# Altium schematic sheet UAV2.0_DOC.SchDoc
size A4
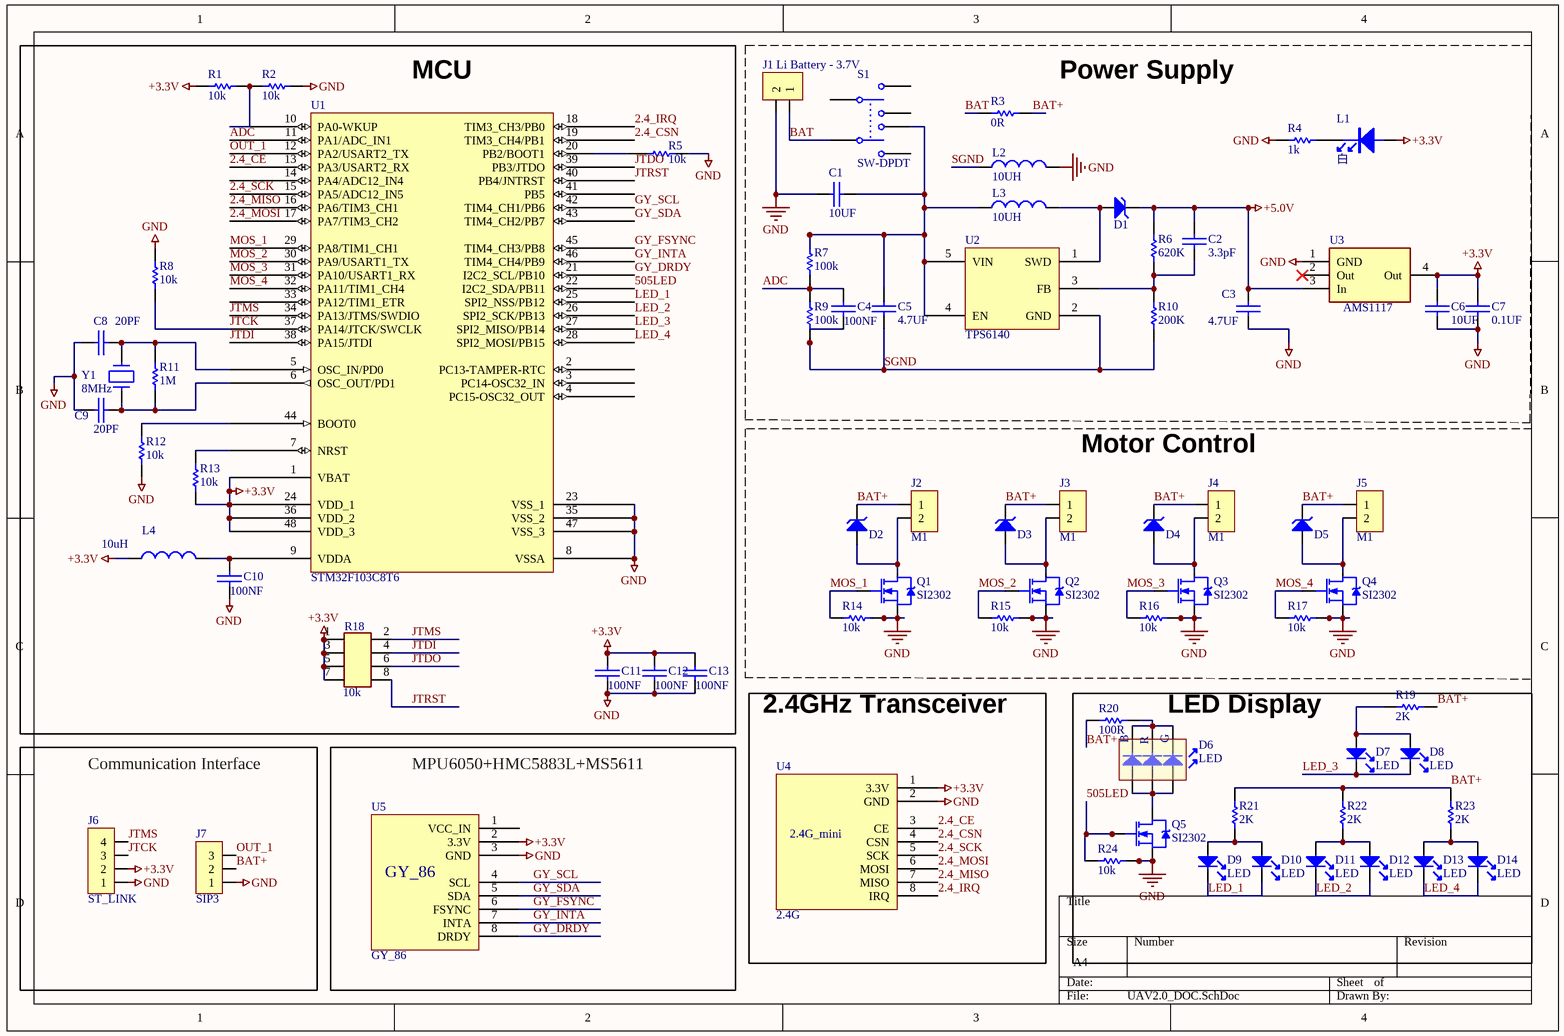
[diagram p0: UAV2.0_DOC.SchDoc]

## Parts
C1  10UF  [1206C]
C2  3.3pF  [0805C]
C3  4.7UF  [1206C]
C4  100NF  [0805C]
C5  4.7UF  [0805C]
C6  10UF  [1206C]
C7  0.1UF  [0805C]
C8  20PF  [0805C]
C9  20PF  [0805C]
C10  100NF  [0805C]
C11  100NF  [0805C]
C12  100NF  [0805C]
C13  100NF  [0805C]
D1  DIODE-S  [C_SMA_3216]  (value not drawn)
D2  DIODE-S  [C_SMA_3216]  (value not drawn)
D3  DIODE-S  [C_SMA_3216]  (value not drawn)
D4  DIODE-S  [C_SMA_3216]  (value not drawn)
D5  DIODE-S  [C_SMA_3216]  (value not drawn)
D6  LED  [LED5050_RGB]
D7  LED  [0805D]
D8  LED  [0805D]
D9  LED  [0805D]
D10  LED  [0805D]
D11  LED  [0805D]
D12  LED  [0805D]
D13  LED  [0805D]
D14  LED  [0805D]
J1  Li Battery - 3.7V  [P2_2.0-2]
J2  M1  [P2_2.0-1]
J3  M1  [P2_2.0-1]
J4  M1  [P2_2.0-1]
J5  M1  [P2_2.0-1]
J6  ST_LINK  [P4_2.54-1]
J7  SIP3  [PC_3]
L1  白  [D0805]
L2  10UH  [1206]
L3  10UH  [1206]
L4  Val: 10uH  [R0805]  (hidden comment: INDUCTOR)
Q1  SI2302  [SI2302]
Q2  SI2302  [SI2302]
Q3  SI2302  [SI2302]
Q4  SI2302  [SI2302]
Q5  SI2302  [SI2302]
R1  Val: 10k  [R0805]  (hidden comment: RES)
R2  Val: 10k  [R0805]  (hidden comment: RES)
R3  0R  [2512R - duplicate]
R4  value 1k  [R0805]  (hidden comment: Res1)
R5  Val: 10k  [R0805]  (hidden comment: RES)
R6  620K  [0805R]
R7  Val: 100k  [R0805]  (hidden comment: RES)
R8  Val: 10k  [R0805]  (hidden comment: RES)
R9  Val: 100k  [R0805]  (hidden comment: RES)
R10  200K  [0805R]
R11  Val: 1M  [R0805]  (hidden comment: RES)
R12  Val: 10k  [R0805]  (hidden comment: RES)
R13  Val: 10k  [R0805]  (hidden comment: RES)
R14  Val: 10k  [R0805]  (hidden comment: RES)
R15  Val: 10k  [R0805]  (hidden comment: RES)
R16  Val: 10k  [R0805]  (hidden comment: RES)
R17  Val: 10k  [R0805]  (hidden comment: RES)
R18  10k  [8P4R_0603]
R19  Val: 2K  [R0805]  (hidden comment: RES)
R20  100R  [0805R]
R21  Val: 2K  [R0805]  (hidden comment: RES)
R22  Val: 2K  [R0805]  (hidden comment: RES)
R23  Val: 2K  [R0805]  (hidden comment: RES)
R24  Val: 10k  [R0805]  (hidden comment: RES)
S1  SW-DPDT  [KEY_KFT7.0]
U1  STM32F103C8T6  [LQFP48_N]
U2  TPS6140  [SOT-23-5]
U3  AMS1117  [ZZ311]
U4  2.4G  [2.4G_mini]
U5  GY_86  [P8_2.54-1]
Y1  Val: 8MHz  [Y2]  (hidden comment: CRYSTAL1)

## Blocks framed on the sheet
MCU: C8-C13 L4 R1 R2 R5 R8 R11-R13 R18 U1 Y1
Motor Control: D2-D5 J2-J5 Q1-Q4 R14-R17
2.4GHz Transceiver: U4
LED Display: D6-D14 Q5 R19-R24
Communication Interface: J6 J7
MPU6050+HMC5883L+MS5611: U5

## Nets
+3.3V: C6.1 C7.1 C11.1 C12.1 C13.1 J6.2 L1.1 L4.1 R1.2 R13.1 R18.1(P) R18.3(P) R18.5(P) R18.7(P) U1.1(VBAT) U1.24(VDD_1) U1.36(VDD_2) U1.48(VDD_3) U3.4(Out) U4.1(3.3V) U5.2(3.3V)
+5.0V: C2.1 C3.1 D1.2 R6.2 U3.3(In)
GND: C1.1 C3.2 C6.2 C7.2 C8.1 C9.1 C10.2 C11.2 C12.2 C13.2 J1.2 J6.1 J7.1 L2.1 Q1.2(S) Q2.2(S) Q3.2(S) Q4.2(S) Q5.2(S) R2.1 R4.2 R5.2 R8.2 R12.1 R14.1 R15.1 R16.1 R17.1 R24.1 U1.8(VSSA) U1.23(VSS_1) U1.35(VSS_2) U1.47(VSS_3) U3.1(GND) U4.2(GND) U5.3(GND)
2.4_CE: U1.13(PA3/USART2_RX) U4.3(CE)
2.4_CSN: U1.19(TIM3_CH4/PB1) U4.4(CSN)
2.4_IRQ: U1.18(TIM3_CH3/PB0) U4.8(IRQ)
2.4_MISO: U1.16(PA6/TIM3_CH1) U4.7(MISO)
2.4_MOSI: U1.17(PA7/TIM3_CH2) U4.6(MOSI)
2.4_SCK: U1.15(PA5/ADC12_IN5) U4.5(SCK)
505LED: Q5.1(G) R24.2 U1.22(I2C2_SDA/PB11)
ADC: C4.1 R7.2 R9.1 U1.11(PA1/ADC_IN1)
BAT: J1.1 R3.1 S1.4
BAT+: D2.2 D3.2 D4.2 D5.2 J2.1 J3.1 J4.1 J5.1 J7.2 R3.2 R19.2 R20.1 R21.1 R22.1 R23.1
GY_DRDY: U1.21(I2C2_SCL/PB10) U5.8(DRDY)
GY_FSYNC: U1.45(TIM4_CH3/PB8) U5.6(FSYNC)
GY_INTA: U1.46(TIM4_CH4/PB9) U5.7(INTA)
GY_SCL: U1.42(TIM4_CH1/PB6) U5.4(SCL)
GY_SDA: U1.43(TIM4_CH2/PB7) U5.5(SDA)
JTCK: J6.3 R8.1 U1.37(PA14/JTCK/SWCLK)
JTDI: R18.4(P) U1.38(PA15/JTDI)
JTDO: R18.6(P) U1.39(PB3/JTDO)
JTMS: J6.4 R18.2(P) U1.34(PA13/JTMS/SWDIO)
JTRST: R18.8(P) U1.40(PB4/JNTRST)
LED_1: D9.2 D10.2 U1.25(SPI2_NSS/PB12)
LED_2: D11.2 D12.2 U1.26(SPI2_SCK/PB13)
LED_3: D7.2 D8.2 U1.27(SPI2_MISO/PB14)
LED_4: D13.2 D14.2 U1.28(SPI2_MOSI/PB15)
MOS_1: Q1.1(G) R14.2 U1.29(PA8/TIM1_CH1)
MOS_2: Q2.1(G) R15.2 U1.30(PA9/USART1_TX)
MOS_3: Q3.1(G) R16.2 U1.31(PA10/USART1_RX)
MOS_4: Q4.1(G) R17.2 U1.32(PA11/TIM1_CH4)
OUT_1: J7.3 U1.12(PA2/USART2_TX)
SGND: C4.2 C5.2 L2.2 R9.2 R10.1 U2.2(GND)
NetC1_2: C1.2 C5.1 L3.2 R7.1 S1.5 U2.4(EN) U2.5(VIN)
NetC2_2: C2.2 R6.1 R10.2 U2.3(FB)
NetC8_2: C8.2 R11.2 U1.5(OSC_IN/PD0) Y1.2
NetC9_2: C9.2 R11.1 U1.6(OSC_OUT/PD1) Y1.1
NetC10_1: C10.1 L4.2 U1.9(VDDA)
NetD1_1: D1.1 L3.1 U2.1(SWD)
NetD2_1: D2.1 J2.2 Q1.3(D)
NetD3_1: D3.1 J3.2 Q2.3(D)
NetD4_1: D4.1 J4.2 Q3.3(D)
NetD5_1: D5.1 J5.2 Q4.3(D)
NetD6_1: D6.1 D6.2 D6.3 R20.2
NetD6_4: D6.4 D6.5 D6.6 Q5.3(D)
NetD7_1: D7.1 D8.1 R19.1
NetD9_1: D9.1 D10.1 R21.2
NetD11_1: D11.1 D12.1 R22.2
NetD13_1: D13.1 D14.1 R23.2
NetL1_2: L1.2 R4.1
NetR1_1: R1.1 R2.2 U1.10(PA0-WKUP)
NetR5_1: R5.1 U1.20(PB2/BOOT1)
NetR12_2: R12.2 U1.44(BOOT0)
NetR13_2: R13.2 U1.7(NRST)

Not connected (* = marked no-connect by the designer): S1 1 2 3 6; U1 2(PC13-TAMPER-RTC) 3(PC14-OSC32_IN) 4(PC15-OSC32_OUT) 14(PA4/ADC12_IN4) 33(PA12/TIM1_ETR) 41(PB5); U3 2(Out)*; U5 1(VCC_IN)

## Notes on the sheet
- (near R3) Power Supply
- (in symbol LED_5050RGB) B; G; R

## Library data of the parts
C1-C13 = CAP: Capacitor/小容量电容
D1-D5 = DIODE-S: SCHOTTKEY
D6 = LED_5050RGB
J1-J5 = SIP2
J6 = SIP4
L1 = LED
L2 L3 = L
R1 R2 R5 R7-R9 R11-R17 R19 R21-R24 = RES: Semiconductor Resistor; Published: *; LatestRevisionDate: *; LatestRevisionNote: *; PackageReference: *; Publisher: *
R3 = Res_1
R4 = Res1: Resistor; Published: 8-Jun-2000; LatestRevisionDate: 17-Jul-2002; LatestRevisionNote: Re-released for DXP Platform.; Publisher: Altium Limited
R6 R10 R20 = Res
R18 = 8P4R_0603
S1 = SW-DPDT: Double-Pole, Double-Throw Switch; Published: 24-Mar-1999; LatestRevisionDate: 17-Jul-2002; LatestRevisionNote: Re-released for DXP Platform.; PackageReference: DPDT-6; Publisher: Altium Limited; PackageDescription: Switch; 6 Leads
U1 = STM32F103C8T6: STM32 ARM-based 32-bit MCU with 64 Kbytes Flash, 48-pin LQFP, Industrial Temperature; Published: *; DatasheetVersion: *; PackageVersion: *; PackageReference: *; Publisher: *; PackageDescription: *; ComponentLink1Description: *; ComponentLink1URL: *; ComponentLink2Description: *; ComponentLink2URL: *
U3 = AMS1117: Header, 2-Pin; LatestRevisionDate: *; LatestRevisionNote: *; Publisher: *
U4 = 2.4G_mini